# EAGLE schematic RemoteRx (EAGLE 7.2.0)
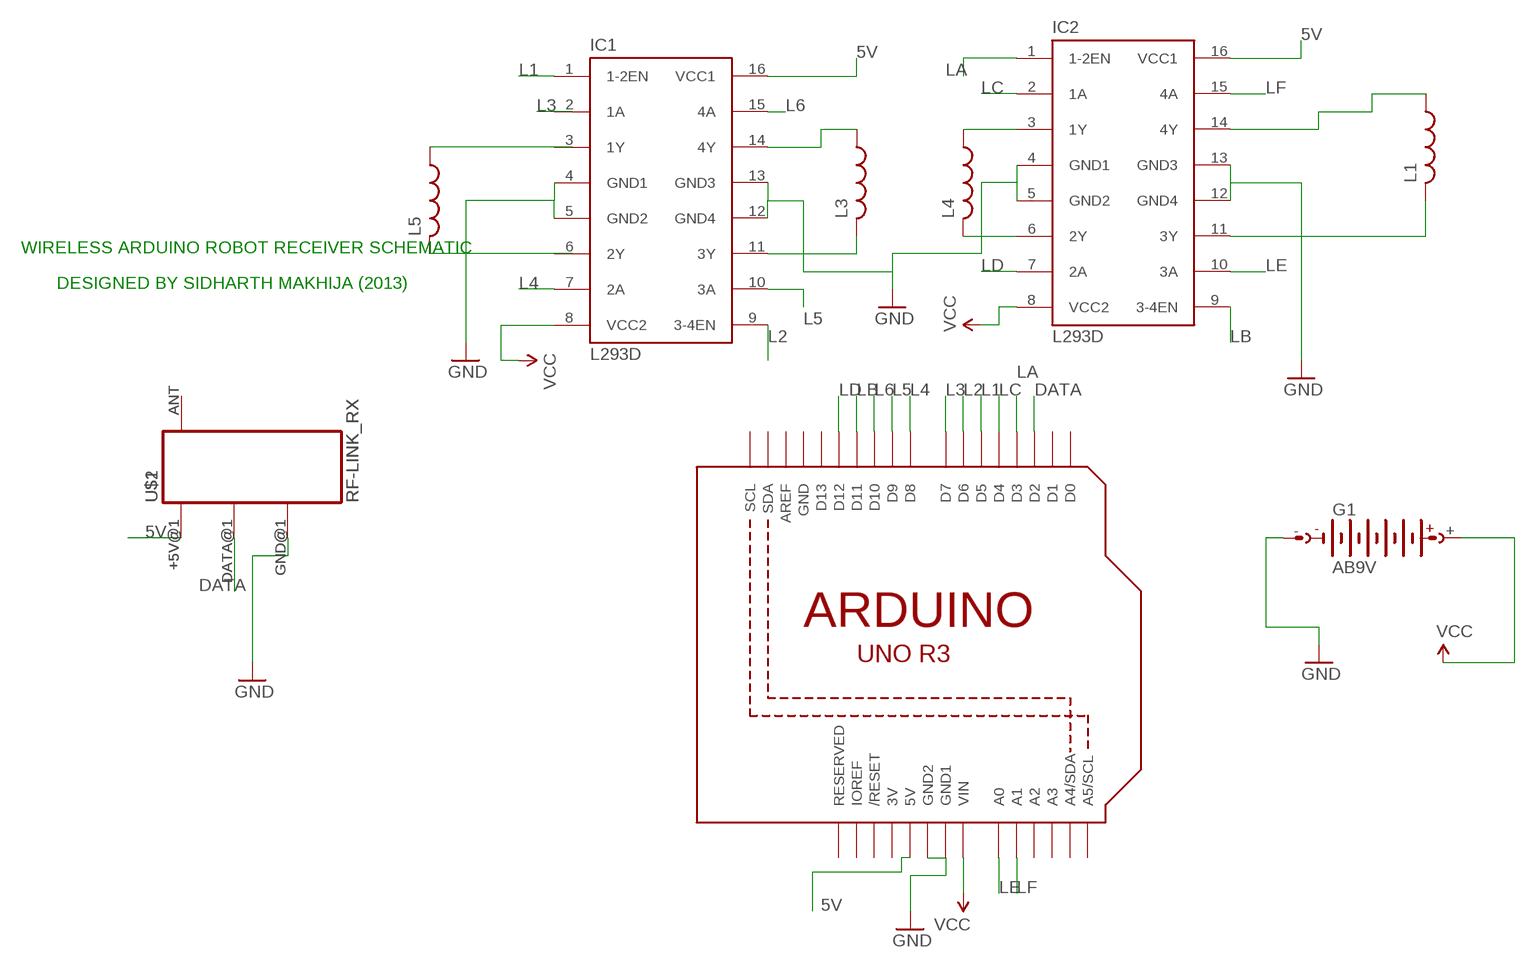
[diagram p0: schematic, sheet 1]

## Parts
G1  AB9V  [AB9V]
IC1  L293D  [DIL16]
IC2  L293D  [DIL16]
L1  L-US6000-XXX-RC  [6000-XXXX-RC]
L3  L-US6000-XXX-RC  [6000-XXXX-RC]
L4  L-US6000-XXX-RC  [6000-XXXX-RC]
L5  L-US6000-XXX-RC  [6000-XXXX-RC]
U1  ARDUINOR3-BPLACE  [ARDUINOR3-BPLACE]
U$1  RF-LINK_RX  [RF-LINK_RX]
U$2  RF-LINK_RX  [RF-LINK_RX]

## Nets
5V: IC1.16(VCC1) IC2.16(VCC1) U1.5V U$1.+5V@1(+5V) U$2.+5V@1(+5V)
DATA: U1.D2 U$1.DATA@1(DATA) U$2.DATA@1(DATA)
GND: G1.- IC1.4(GND1) IC1.5(GND2) IC1.12(GND4) IC1.13(GND3) IC2.4(GND1) IC2.5(GND2) IC2.12(GND4) IC2.13(GND3) U1.GND1 U1.GND2 U$1.GND@1(GND) U$2.GND@1(GND)
L1: IC1.1(1-2EN) U1.D5
L2: IC1.9(3-4EN) U1.D6
L3: U1.D7
L4: IC1.7(2A) U1.D8
L5: IC1.10(3A) U1.D9
L6: IC1.15(4A) U1.D10
LA: IC2.1(1-2EN) U1.D3
LB: IC2.9(3-4EN) U1.D11
LC: IC2.2(1A) U1.D4
LD: IC2.7(2A) U1.D12
LE: IC2.10(3A) U1.A0
LF: IC2.15(4A) U1.A1
N$2: U$1.ANT U$2.ANT
N$5: L5.1
N$6: L5.2
N$7: IC1.11(3Y) L3.2
N$8: IC1.14(4Y) L3.1
N$9: IC2.3(1Y) L4.1
N$10: IC2.6(2Y) L4.2
N$11: IC2.14(4Y) L1.1
N$12: IC2.11(3Y) L1.2
VCC: G1.+ IC1.8(VCC2) IC2.8(VCC2) U1.VIN
Unconnected: IC1.2(1A) IC1.3(1Y) IC1.6(2Y) U1.A2 U1.A3 U1.A4(A4/SDA) U1.A5(A5/SCL) U1.AREF U1.D0 U1.D1 U1.D13 U1.IOREF U1.RESERVED U1.RESET(/RESET) U1.SCL U1.SDA

## Notes on the sheet
- WIRELESS ARDUINO ROBOT RECEIVER SCHEMATIC
- DESIGNED BY SIDHARTH MAKHIJA (2013)

## Power pins joined to a net without a drawn wire
3V: U1.3V
GND: U1.GND

## Library data of the parts
G1 = battery:AB9V: 9-V BATTERY CLIP
IC1 IC2 = st-microelectronics:L293D: PUSH-PULL 4 CHANNEL DRIVER; MPN: L293D; OC_FARNELL: 9589619; OC_NEWARK: 56P8249
L1 L3-L5 = rcl:L-US: INDUCTOR, American symbol
U1 = adafruit:ARDUINOR3: This is a new object for the new Arduino R3 - with extra pins that you may want to use (such as IOref, and duplicated A4/A5
U$1 U$2 = SparkFun-RF:RF-LINK_RX: RF Link receivers- WRL-8947, 8948, 8949, 8950, 10532, 10533